# Altium schematic sheet Sitara_Sheet1.SchDoc
size A4; CompanyName: SPAN; Engineer: Anh Luong; Organization: University of Utah; Address1: 50 S Central Campus Dr; Address2: MEB Rm 3129; Address3: Salt Lake City, Utah 84115; Address4: USA; Revision: 1; SheetNumber: 1; SheetTotal: 1
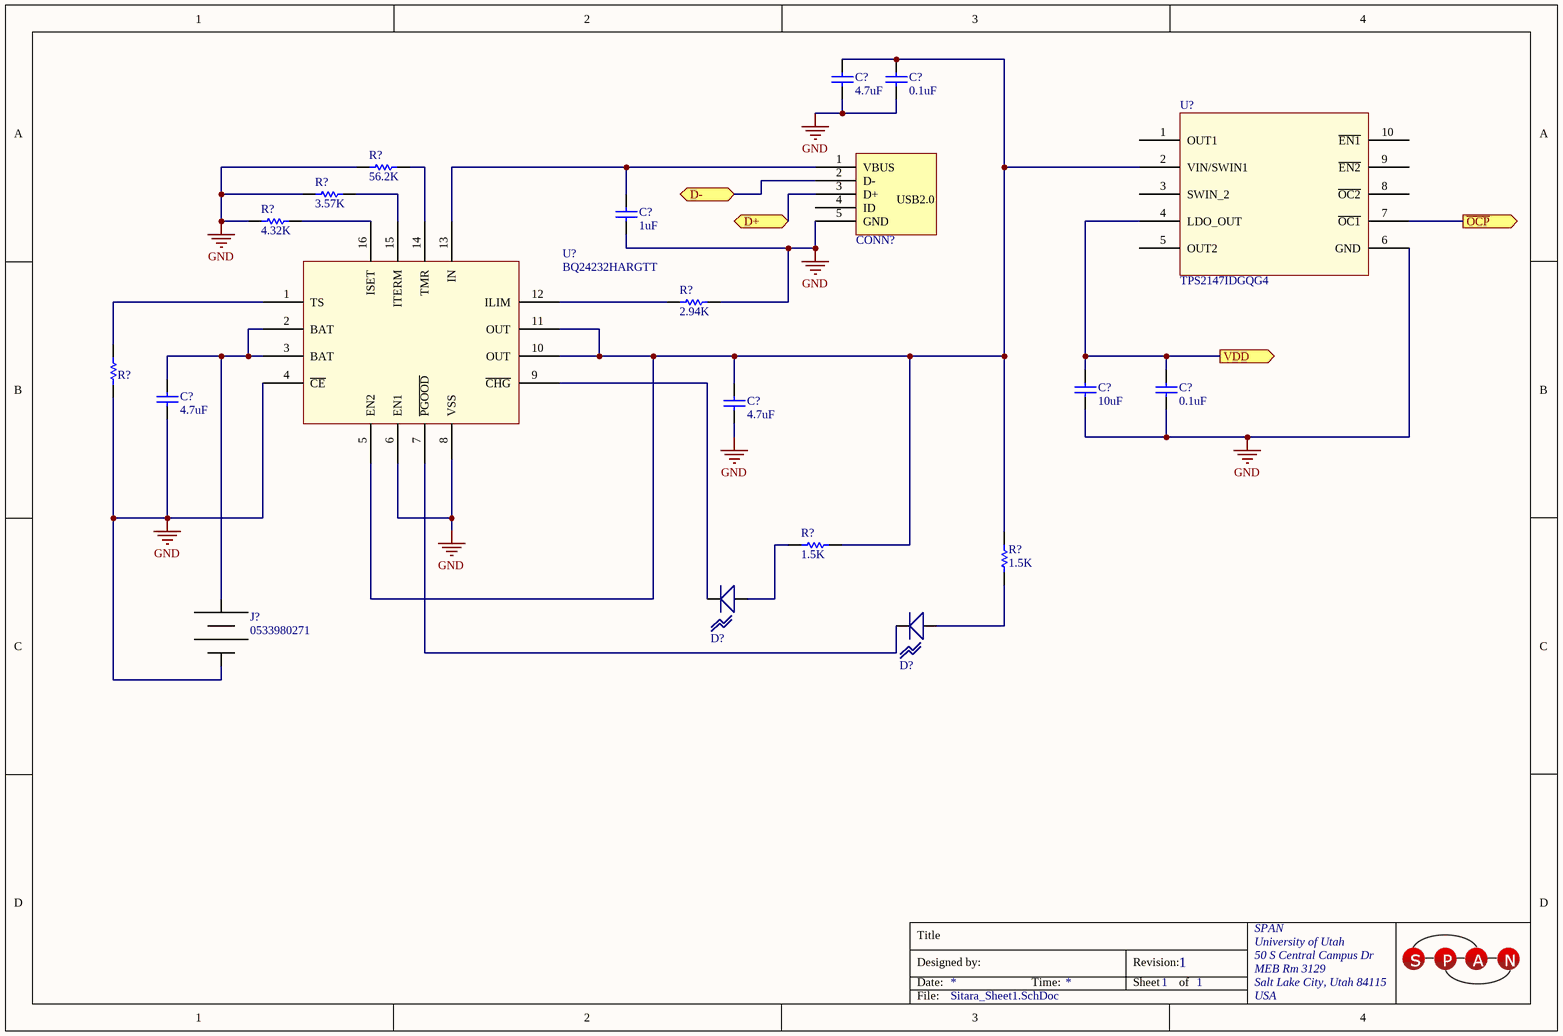
[diagram p0: Sitara_Sheet1.SchDoc]

## Parts
(Parts that share a designator on the sheet are numbered #1, #2 ... from top to bottom, then left to right.)
C?#1  4.7uF
C?#2  0.1uF
C?#3  1uF
C?#4  0.1uF
C?#5  10uF
C?#6  4.7uF
C?#7  4.7uF
CONN?  10118193-0001LF  (value not drawn)
D?#1  LTST-C191KFKT  (value not drawn)
D?#2  LTST-C191KFKT  (value not drawn)
J?  0533980271  [53398-0271]
R?#1  56.2K
R?#2  3.57K
R?#3  4.32K
R?#4  2.94K
R?#5  10K  (value not drawn)
R?#6  1.5K
R?#7  1.5K
U?#1  TPS2147IDGQG4
U?#2  BQ24232HARGTT

## Ports
D+ (bidir), D- (bidir), VDD (out), ~{OCP} (out)

## Nets
GND: C?#1.* C?#2.8 C?#3.14 C?#4.9 C?#5.10 C?#6.* C?#7.* CONN?.5(GND) J?.2(Neg) R?#1.20 R?#2.16 R?#3.18 R?#4.23 R?#5.0 U?#1.6(GND) U?#2.4(~{CE}) U?#2.6(EN1) U?#2.8(VSS)
D+: CONN?.3(D+) ; port D+
D-: CONN?.2(D-) ; port D-
~{OCP}: U?#1.7(~{OC1}) ; port ~{OCP}
VDD: C?#4.8 C?#5.11 U?#1.4(LDO_OUT) ; port VDD
NetC?#1_7: C?#1.7 C?#2.9 C?#7.7 R?#6.13 R?#7.13 U?#1.2(VIN/SWIN1) U?#2.5(EN2) U?#2.10(OUT) U?#2.11(OUT)
NetC?#3_15: C?#3.15 CONN?.1(VBUS) U?#2.13(IN)
NetC?#6_7: C?#6.7 J?.1(Pos) U?#2.2(BAT) U?#2.3(BAT)
NetD?#1_0: D?#1.0 R?#6.12
NetD?#1_1: D?#1.1 U?#2.9(~{CHG})
NetD?#2_0: D?#2.0 R?#7.12
NetD?#2_1: D?#2.1 U?#2.7(~{PGOOD})
NetR?#1_21: R?#1.21 U?#2.14(TMR)
NetR?#2_17: R?#2.17 U?#2.15(ITERM)
NetR?#3_19: R?#3.19 U?#2.16(ISET)
NetR?#4_22: R?#4.22 U?#2.12(ILIM)
NetR?#5_1: R?#5.1 U?#2.1(TS)

Not connected (* = marked no-connect by the designer): CONN? 4(ID); U?#1 1(OUT1) 3(SWIN_2) 5(OUT2) 8(~{OC2}) 9(~{EN2}) 10(~{EN1})

## Notes on the sheet
- Title
- Designed by:
- Date:
- Time:
- Revision:
- Sheet
- of
- File:
- (in symbol 10118193-0001LF) USB2.0

## Library data of the parts
C?#1 C?#6 C?#7 = JMK107BJ475MAHT: Manufacturer: Taiyo Yuden; Capacitance: 4.7µF; Tolerance: ±20%; Voltage - Rated: 6.3V; Temperature Coefficient: X5R; Supplier 1: Digi-Key; Manufacturer Part Number: JMK107BJ475MAHT; RoHS: RoHS Compliant; Category: Capacitors; Stock 1: 4000; Pricing 1: 4000=0.03053, 8000=0.0284, 12000=0.02698, 28000=0.02556, 100000=0.01935 (USD); Packaging: Tape & Reel (TR); Part Status: Active; Operating Temperature: -55°C ~ 85°C; Features: -; Ratings: AEC-Q200; Applications: Automotive, SMPS Filtering; Failure Rate: -; Mounting Type: Surface Mount, MLCC; Package / Case: 0603 (1608 Metric); Size / Dimension: 0.063" L x 0.031" W (1.60mm x 0.80mm); Height - Seated (Max): -; Thickness (Max): 0.035" (0.90mm); Lead Spacing: -; Lead Style: -; ComponentLink1URL: http://www.yuden.co.jp/productdata/catalog/en/mlcc_all_hq_e.pdf; ComponentLink1Description: http://www.yuden.co.jp/productdata/catalog/en/mlcc_all_hq_e.pdf; Supplier Part Number 1: 587-4903-2-ND
C?#2 C?#4 = 0603YC104KAT4A: CAP CER 0.1UF 16V X7R 0603; Manufacturer: AVX Corporation; Capacitance: 0.1µF; Tolerance: ±10%; Supplier 1: Digi-Key; Manufacturer Part Number: 0603YC104KAT4A; RoHS: RoHS Compliant; Category: Capacitors; Stock 1: 15000; Pricing 1: 15000=0.00344, 30000=0.00327, 75000=0.00292, 105000=0.00237 (USD); Packaging: Tape & Reel (TR); Part Status: Active; Voltage - Rated: 16V; Temperature Coefficient: X7R; Operating Temperature: -55°C ~ 125°C; Features: -; Ratings: -; Applications: General Purpose; Failure Rate: -; Mounting Type: Surface Mount, MLCC; Package / Case: 0603 (1608 Metric); Size / Dimension: 0.063" L x 0.032" W (1.60mm x 0.81mm); Height - Seated (Max): -; Thickness (Max): 0.035" (0.90mm); Lead Spacing: -; Lead Style: -; ComponentLink1URL: http://datasheets.avx.com/X7RDielectric.pdf; ComponentLink1Description: http://datasheets.avx.com/X7RDielectric.pdf; Supplier Part Number 1: 478-10054-2-ND
C?#3 = JMK107C6105KA-T: CAP CER 1uF SMD; Manufacturer: Taiyo Yuden; Capacitance: 1µF; Tolerance: ±10%; Voltage - Rated: 6.3V; Temperature Coefficient: X6S; Supplier 1: Digi-Key; Manufacturer Part Number: JMK107C6105KA-T; RoHS: RoHS Compliant; Category: Capacitors; Stock 1: 8000; Pricing 1: 4000=0.02281, 8000=0.02122, 12000=0.02016, 28000=0.0191, 100000=0.01446 (USD); Packaging: Tape & Reel (TR); Part Status: Active; Operating Temperature: -55°C ~ 105°C; Features: -; Ratings: -; Applications: SMPS Filtering; Failure Rate: -; Mounting Type: Surface Mount, MLCC; Package / Case: 0603 (1608 Metric); Size / Dimension: 0.063" L x 0.031" W (1.60mm x 0.80mm); Height - Seated (Max): -; Thickness (Max): 0.035" (0.90mm); Lead Spacing: -; Lead Style: -; ComponentLink1URL: http://www.yuden.co.jp/productdata/catalog/en/mlcc_all_e.pdf; ComponentLink1Description: http://www.yuden.co.jp/productdata/catalog/en/mlcc_all_e.pdf; Supplier Part Number 1: 587-4904-2-ND
C?#5 = EMK107BC6106MA-T: CAP CER 10uF; Manufacturer: Taiyo Yuden; Capacitance: 10µF; Tolerance: ±20%; Voltage - Rated: 16V; Temperature Coefficient: X6S; Supplier 1: Digi-Key; Manufacturer Part Number: EMK107BC6106MA-T; RoHS: RoHS Compliant; Category: Capacitors; Stock 1: 0; Pricing 1: 4000=0.08689, 8000=0.08178, 12000=0.07922, 28000=0.07667, 100000=0.06798 (USD); Packaging: Tape & Reel (TR); Part Status: Active; Operating Temperature: -55°C ~ 105°C; Features: -; Ratings: -; Applications: SMPS Filtering; Failure Rate: -; Mounting Type: Surface Mount, MLCC; Package / Case: 0603 (1608 Metric); Size / Dimension: 0.063" L x 0.031" W (1.60mm x 0.80mm); Height - Seated (Max): -; Thickness (Max): 0.039" (1.00mm); Lead Spacing: -; Lead Style: -; ComponentLink1URL: http://www.yuden.co.jp/productdata/catalog/en/mlcc06_e.pdf; ComponentLink1Description: http://www.yuden.co.jp/productdata/catalog/en/mlcc06_e.pdf; Supplier Part Number 1: 587-4867-2-ND
CONN? = 10118193-0001LF: CONN USB MICRO B RECPT SMT R/A; Manufacturer: Amphenol FCI; Connector Type: USB - micro B; Number of Contacts: 5; Gender: Receptacle; Specifications: USB 2.0; Number of Ports: 1; Current Rating: 1.8A per Contact; Voltage - Rated: 100VAC; Mating Cycles: 10000; Shielding: Shielded; Material Flammability Rating: UL94 V-0; Supplier 1: Digi-Key; Manufacturer Part Number: 10118193-0001LF; RoHS: RoHS Compliant; Category: Connectors, Interconnects; Stock 1: 88800; Pricing 1: 1200=0.19845, 2400=0.18144, 6000=0.1701, 8400=0.15876, 12000=0.15309, 30000=0.15082, 60000=0.14742 (USD); Packaging: Tape & Reel (TR); Part Status: Active; Mounting Type: Surface Mount, Right Angle; Through Hole; Mounting Feature: Horizontal; Termination: Solder; Features: Solder Retention; Ingress Protection: -; Operating Temperature: -30°C ~ 80°C; Contact Finish: Gold; Shell/Shielding Material: Steel, Stainless; Insulation Color: Black; ComponentLink1URL: http://portal.fciconnect.com/Comergent//fci/drawing/10118193.pdf; ComponentLink1Description: http://portal.fciconnect.com/Comergent//fci/drawing/10118193.pdf; Supplier Part Number 1: 609-4616-2-ND
D?#1 D?#2 = LTST-C191KFKT: LED ORANGE CLEAR 0603 SMD; Manufacturer: Lite-On Inc.; Lens Color: Colorless; Millicandela Rating: 90mcd; Lens Style/Size: Rectangle with Flat Top, 1.10mm x 0.80mm; Voltage - Forward (Vf) (Typ): 2V; Current - Test: 20mA; Viewing Angle: 130°; Wavelength - Dominant: 605nm; Wavelength - Peak: 611nm; Supplier 1: Digi-Key; Manufacturer Part Number: LTST-C191KFKT; RoHS: RoHS Compliant; Category: Optoelectronics; Stock 1: 160000; Pricing 1: 5000=0.0376, 10000=0.03384, 25000=0.03008, 50000=0.02726, 125000=0.02538 (USD); Packaging: Tape & Reel (TR); Part Status: Active; Color: Orange; Lens Transparency: Clear; Mounting Type: Surface Mount; Features: -; Package / Case: 0603 (1608 Metric); Size / Dimension: 1.60mm L x 0.80mm W; Height (Max): 0.55mm; ComponentLink1URL: http://optoelectronics.liteon.com/upload/download/DS22-2000-222/S_110_LTST-C191KFKT.pdf; ComponentLink1Description: http://optoelectronics.liteon.com/upload/download/DS22-2000-222/S_110_LTST-C191KFKT.pdf; Supplier Part Number 1: 160-1445-2-ND
J? = 0533980271: CONN HEADER 2POS 1.25MM VERT SMD; Manufacturer: Molex Inc; Connector Type: Header, Male Blades; Number of Positions: 2; Pitch: 0.049" (1.25mm); Supplier 1: Digi-Key; RoHS: RoHS Compliant; Category: Connectors, Interconnects; Stock 1: 14126; Pricing 1: 1=1.4, 10=1.091, 25=1.0168, 50=0.923, 100=0.8323, 250=0.7014, 500=0.66448 (USD); Connector Style: -; Mounting Type: Surface Mount; Termination: Solder; Wire Gauge: -; Features: -; Color: Natural; Packaging: Cut Tape (CT); ComponentLink1URL: http://www.molex.com/pdm_docs/sd/533980271_sd.pdf; ComponentLink1Description: http://www.molex.com/pdm_docs/sd/533980271_sd.pdf; Supplier Part Number 1: WM7606CT-ND; Manufacturer Part Number: 0533980271
R?#1 = ERA-3AEB5622V: RES SMD 56.2KOHM 0.1% 1/10W 0603; Manufacturer: Panasonic Electronic Components; Power (Watts): 0.1W, 1/10W; Temperature Coefficient: ±25ppm/°C; Supplier 1: Digi-Key; Manufacturer Part Number: ERA-3AEB5622V; RoHS: RoHS Compliant; Category: Resistors; Stock 1: 5000; Pricing 1: 5000=0.0354, 10000=0.03304, 25000=0.03139, 50000=0.03075, 125000=0.03009 (USD); Packaging: Tape & Reel (TR); Part Status: Active; Resistance (Ohms): 56.2k; Tolerance: ±0.1%; Composition: Thin Film; Features: Automotive AEC-Q200; Operating Temperature: -55°C ~ 155°C; Package / Case: 0603 (1608 Metric); Supplier Device Package: 0603; Size / Dimension: 0.063" L x 0.031" W (1.60mm x 0.80mm); Height - Seated (Max): 0.022" (0.55mm); Number of Terminations: 2; Failure Rate: -; ComponentLink1URL: https://industrial.panasonic.com/cdbs/www-data/pdf/RDA0000/AOA0000C237.pdf; ComponentLink1Description: https://industrial.panasonic.com/cdbs/www-data/pdf/RDA0000/AOA0000C237.pdf; Supplier Part Number 1: P56.2KDBTR-ND
R?#2 = TNPW06033K57BEEA: RES SMD 3.57KOHM 0.1% 1/10W 0603; Manufacturer: Vishay Dale; Power (Watts): 0.1W, 1/10W; Temperature Coefficient: ±25ppm/°C; Supplier 1: Digi-Key; Manufacturer Part Number: TNPW06033K57BEEA; RoHS: RoHS Compliant; Category: Resistors; Stock 1: 0; Pricing 1: 5000=0.1064 (USD); Packaging: Tape & Reel (TR); Part Status: Active; Resistance (Ohms): 3.57k; Tolerance: ±0.1%; Composition: Thin Film; Features: Anti-Sulfur, Automotive AEC-Q200, Moisture Resistant; Operating Temperature: -55°C ~ 125°C; Package / Case: 0603 (1608 Metric); Supplier Device Package: 0603; Size / Dimension: 0.063" L x 0.033" W (1.60mm x 0.85mm); Height - Seated (Max): 0.022" (0.55mm); Number of Terminations: 2; Failure Rate: -; ComponentLink1URL: http://www.vishay.com/docs/28758/tnpw_e3.pdf; ComponentLink1Description: http://www.vishay.com/docs/28758/tnpw_e3.pdf; Supplier Part Number 1: TNPW06033K57BEEA-ND
R?#3 = ERA-3AEB4321V: RES SMD 4.32KOHM 0.1% 1/10W 0603; Manufacturer: Panasonic Electronic Components; Power (Watts): 0.1W, 1/10W; Temperature Coefficient: ±25ppm/°C; Supplier 1: Digi-Key; Manufacturer Part Number: ERA-3AEB4321V; RoHS: RoHS Compliant; Category: Resistors; Stock 1: 5000; Pricing 1: 5000=0.0354, 10000=0.03304, 25000=0.03139, 50000=0.03075, 125000=0.03009 (USD); Packaging: Tape & Reel (TR); Part Status: Active; Resistance (Ohms): 4.32k; Tolerance: ±0.1%; Composition: Thin Film; Features: Automotive AEC-Q200; Operating Temperature: -55°C ~ 155°C; Package / Case: 0603 (1608 Metric); Supplier Device Package: 0603; Size / Dimension: 0.063" L x 0.031" W (1.60mm x 0.80mm); Height - Seated (Max): 0.022" (0.55mm); Number of Terminations: 2; Failure Rate: -; ComponentLink1URL: https://industrial.panasonic.com/cdbs/www-data/pdf/RDA0000/AOA0000C237.pdf; ComponentLink1Description: https://industrial.panasonic.com/cdbs/www-data/pdf/RDA0000/AOA0000C237.pdf; Supplier Part Number 1: P4.32KDBTR-ND
R?#4 = ERA-3AEB2941V: RES SMD 2.94KOHM 0.1% 1/10W 0603; Manufacturer: Panasonic Electronic Components; Power (Watts): 0.1W, 1/10W; Temperature Coefficient: ±25ppm/°C; Supplier 1: Digi-Key; Manufacturer Part Number: ERA-3AEB2941V; RoHS: RoHS Compliant; Category: Resistors; Stock 1: 10000; Pricing 1: 5000=0.0354, 10000=0.03304, 25000=0.03139, 50000=0.03075, 125000=0.03009 (USD); Packaging: Tape & Reel (TR); Part Status: Active; Resistance (Ohms): 2.94k; Tolerance: ±0.1%; Composition: Thin Film; Features: Automotive AEC-Q200; Operating Temperature: -55°C ~ 155°C; Package / Case: 0603 (1608 Metric); Supplier Device Package: 0603; Size / Dimension: 0.063" L x 0.031" W (1.60mm x 0.80mm); Height - Seated (Max): 0.022" (0.55mm); Number of Terminations: 2; Failure Rate: -; ComponentLink1URL: https://industrial.panasonic.com/cdbs/www-data/pdf/RDA0000/AOA0000C237.pdf; ComponentLink1Description: https://industrial.panasonic.com/cdbs/www-data/pdf/RDA0000/AOA0000C237.pdf; Supplier Part Number 1: P2.94KDBTR-ND
R?#5 = PHT0603Y1002BGT200: RES SMD 10KOHM 0.1% 0.0375W 0603; Manufacturer: Vishay Sfernice; Temperature Coefficient: ±15ppm/°C; Supplier 1: Digi-Key; Manufacturer Part Number: PHT0603Y1002BGT200; RoHS: RoHS Compliant; Category: Resistors; Stock 1: 400; Pricing 1: 200=6.6496, 400=6.0262, 600=5.6106, 1000=5.195 (USD); Packaging: Tape & Reel (TR); Part Status: Active; Resistance (Ohms): 10k; Tolerance: ±0.1%; Power (Watts): 0.0375W; Composition: Thin Film; Features: Anti-Sulfur; Operating Temperature: -55°C ~ 215°C; Package / Case: 0603 (1608 Metric); Supplier Device Package: 0603; Size / Dimension: 0.060" L x 0.033" W (1.52mm x 0.85mm); Height - Seated (Max): 0.025" (0.64mm); Number of Terminations: 2; Failure Rate: -; ComponentLink1URL: http://www.vishay.com/docs/53050/pht.pdf; ComponentLink1Description: http://www.vishay.com/docs/53050/pht.pdf; Supplier Part Number 1: PHTB-10KTR-ND
R?#6 R?#7 = CRCW06031K50JNEA: RES SMD 1.5K OHM 5% 1/10W 0603; Manufacturer: Vishay Dale; Power (Watts): 0.1W, 1/10W; Temperature Coefficient: ±200ppm/°C; Supplier 1: Digi-Key; Manufacturer Part Number: CRCW06031K50JNEA; RoHS: RoHS Compliant; Category: Resistors; Stock 1: 30000; Pricing 1: 5000=0.00266, 10000=0.00231, 25000=0.00203, 50000=0.0019 (USD); Packaging: Tape & Reel (TR); Part Status: Active; Resistance (Ohms): 1.5k; Tolerance: ±5%; Composition: Thick Film; Features: Automotive AEC-Q200; Operating Temperature: -55°C ~ 155°C; Package / Case: 0603 (1608 Metric); Supplier Device Package: 0603; Size / Dimension: 0.063" L x 0.033" W (1.60mm x 0.85mm); Height - Seated (Max): 0.020" (0.50mm); Number of Terminations: 2; Failure Rate: -; ComponentLink1URL: http://www.vishay.com/docs/20035/dcrcwe3.pdf; ComponentLink1Description: http://www.vishay.com/docs/20035/dcrcwe3.pdf; Supplier Part Number 1: 541-1.5KGTR-ND
U?#1 = TPS2147IDGQG4: IC 3.3V LDO/DUAL SWITCH 10-MSOP; Manufacturer: Texas Instruments; Current - Supply: 75µA; Voltage - Supply: 2.9 V ~ 5.5 V; Supplier 1: Digi-Key; RoHS: RoHS Compliant; Category: Integrated Circuits (ICs); Stock 1: 0; Pricing 1: 240=2.808 (USD); Packaging: Tube; Part Status: Active; Applications: USB, Peripherals; Operating Temperature: -40°C ~ 85°C; Mounting Type: Surface Mount; Package / Case: 10-TFSOP, 10-MSOP (0.118", 3.00mm Width) Exposed Pad; Supplier Device Package: 10-MSOP-PowerPad; ComponentLink1URL: http://media.digikey.com/pdf/Data%20Sheets/Texas%20Instruments%20PDFs/TPS2145_47_55_57.pdf; ComponentLink1Description: http://media.digikey.com/pdf/Data%20Sheets/Texas%20Instruments%20PDFs/TPS2145_47_55_57.pdf; Supplier Part Number 1: TPS2147IDGQG4-ND; Manufacturer Part Number: TPS2147IDGQG4
U?#2 = BQ24232HARGTT: IC LI-ION CHARGE PWR MGMT 16VQFN; Manufacturer: Texas Instruments; Battery Chemistry: Lithium-Ion; Number of Cells: 1; Current - Charging: Constant - Programmable; Programmable Features: Current, Timer; Fault Protection: Over Temperature, Over Voltage, Reverse Current, Short Circuit; Charge Current - Max: 500mA; Battery Pack Voltage: 4.2V; Voltage - Supply (Max): 10.2V; Interface: USB; Supplier 1: Digi-Key; RoHS: RoHS Compliant; Category: Integrated Circuits (ICs); Stock 1: 0; Pricing 1: 250=2.09792, 500=1.88244, 1250=1.5876 (USD); Packaging: Tape & Reel (TR); Part Status: Active; Operating Temperature: -5°C ~ 125°C (TJ); Package / Case: 16-VFQFN Exposed Pad; Supplier Device Package: 16-QFN (3x3); ComponentLink1URL: http://www.ti.com/lit/ds/symlink/bq24232ha.pdf; ComponentLink1Description: http://www.ti.com/lit/ds/symlink/bq24232ha.pdf; Supplier Part Number 1: 296-44194-2-ND; Manufacturer Part Number: BQ24232HARGTT